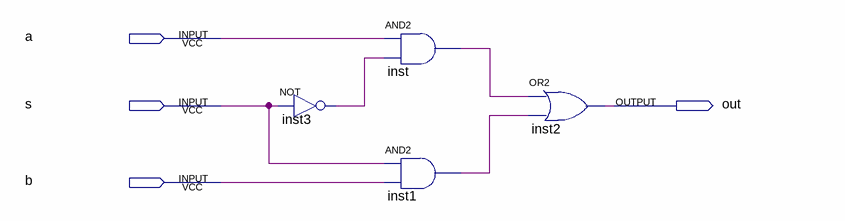
[diagram p0: schematic sheet]
// Quartus schematic 2to1Mux.bdf as structural Verilog: 4 symbols, 4 pins
module \2to1Mux  (
  input  a,
  input  s,
  input  b,
  output out
);

  wire inst1_out, inst3_out, inst_out;

  not inst3 (inst3_out, s);
  and inst (inst_out, a, inst3_out);
  and inst1 (inst1_out, s, b);
  or inst2 (out, inst_out, inst1_out);
endmodule
